# EAGLE design Mixer-Analog-OPA4134-Rev-M2-multi (EAGLE 8.6.0)
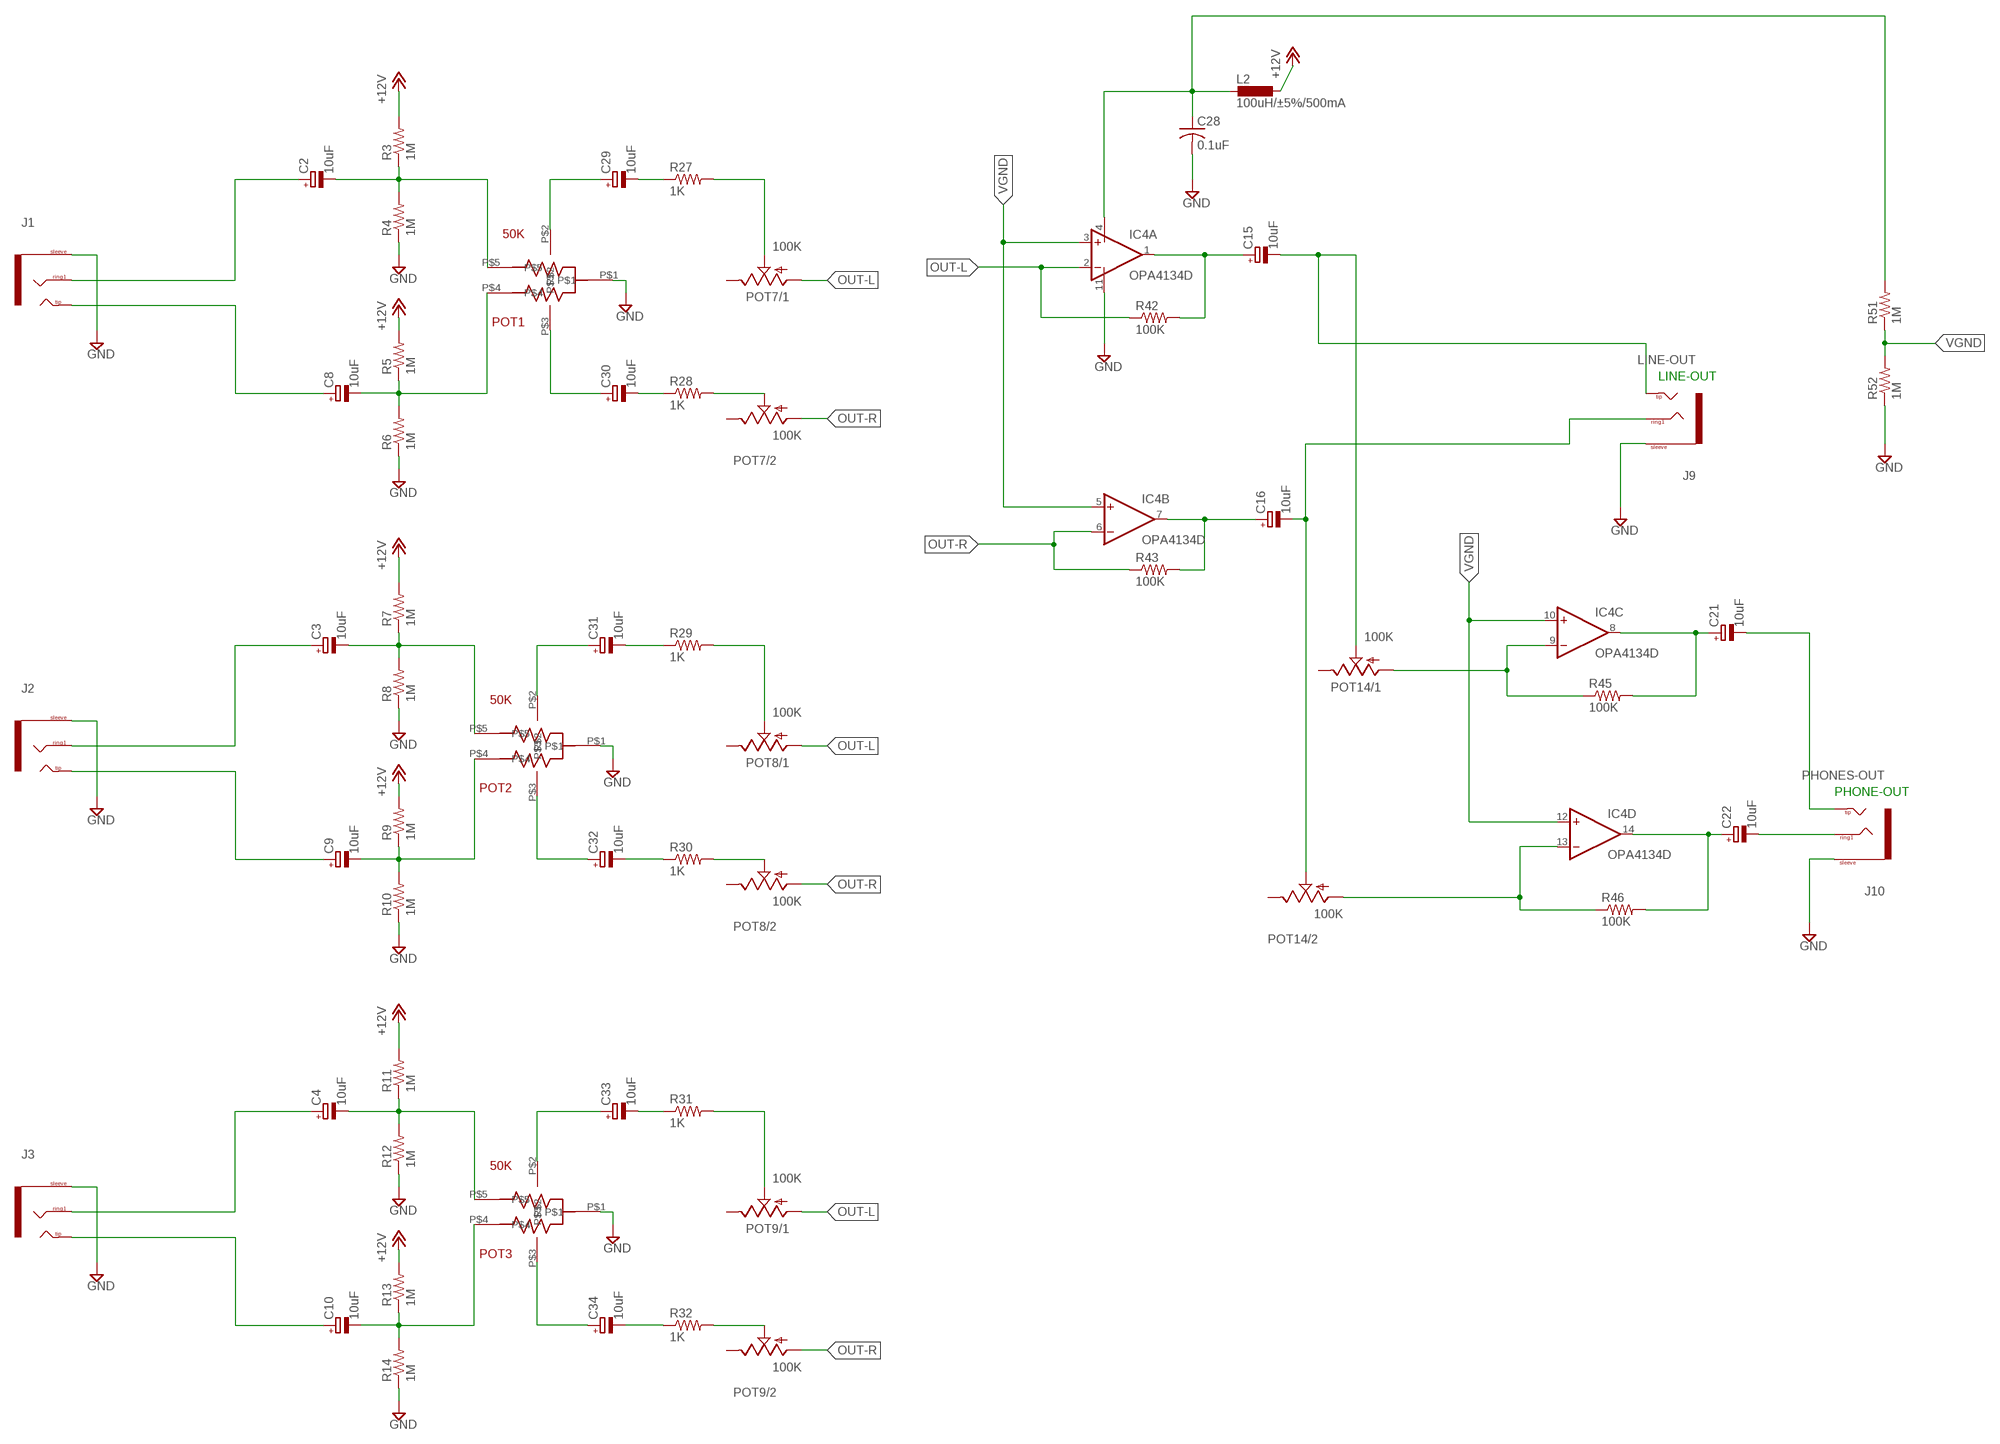
[diagram p0: schematic, sheet 1, part 1 of 2]
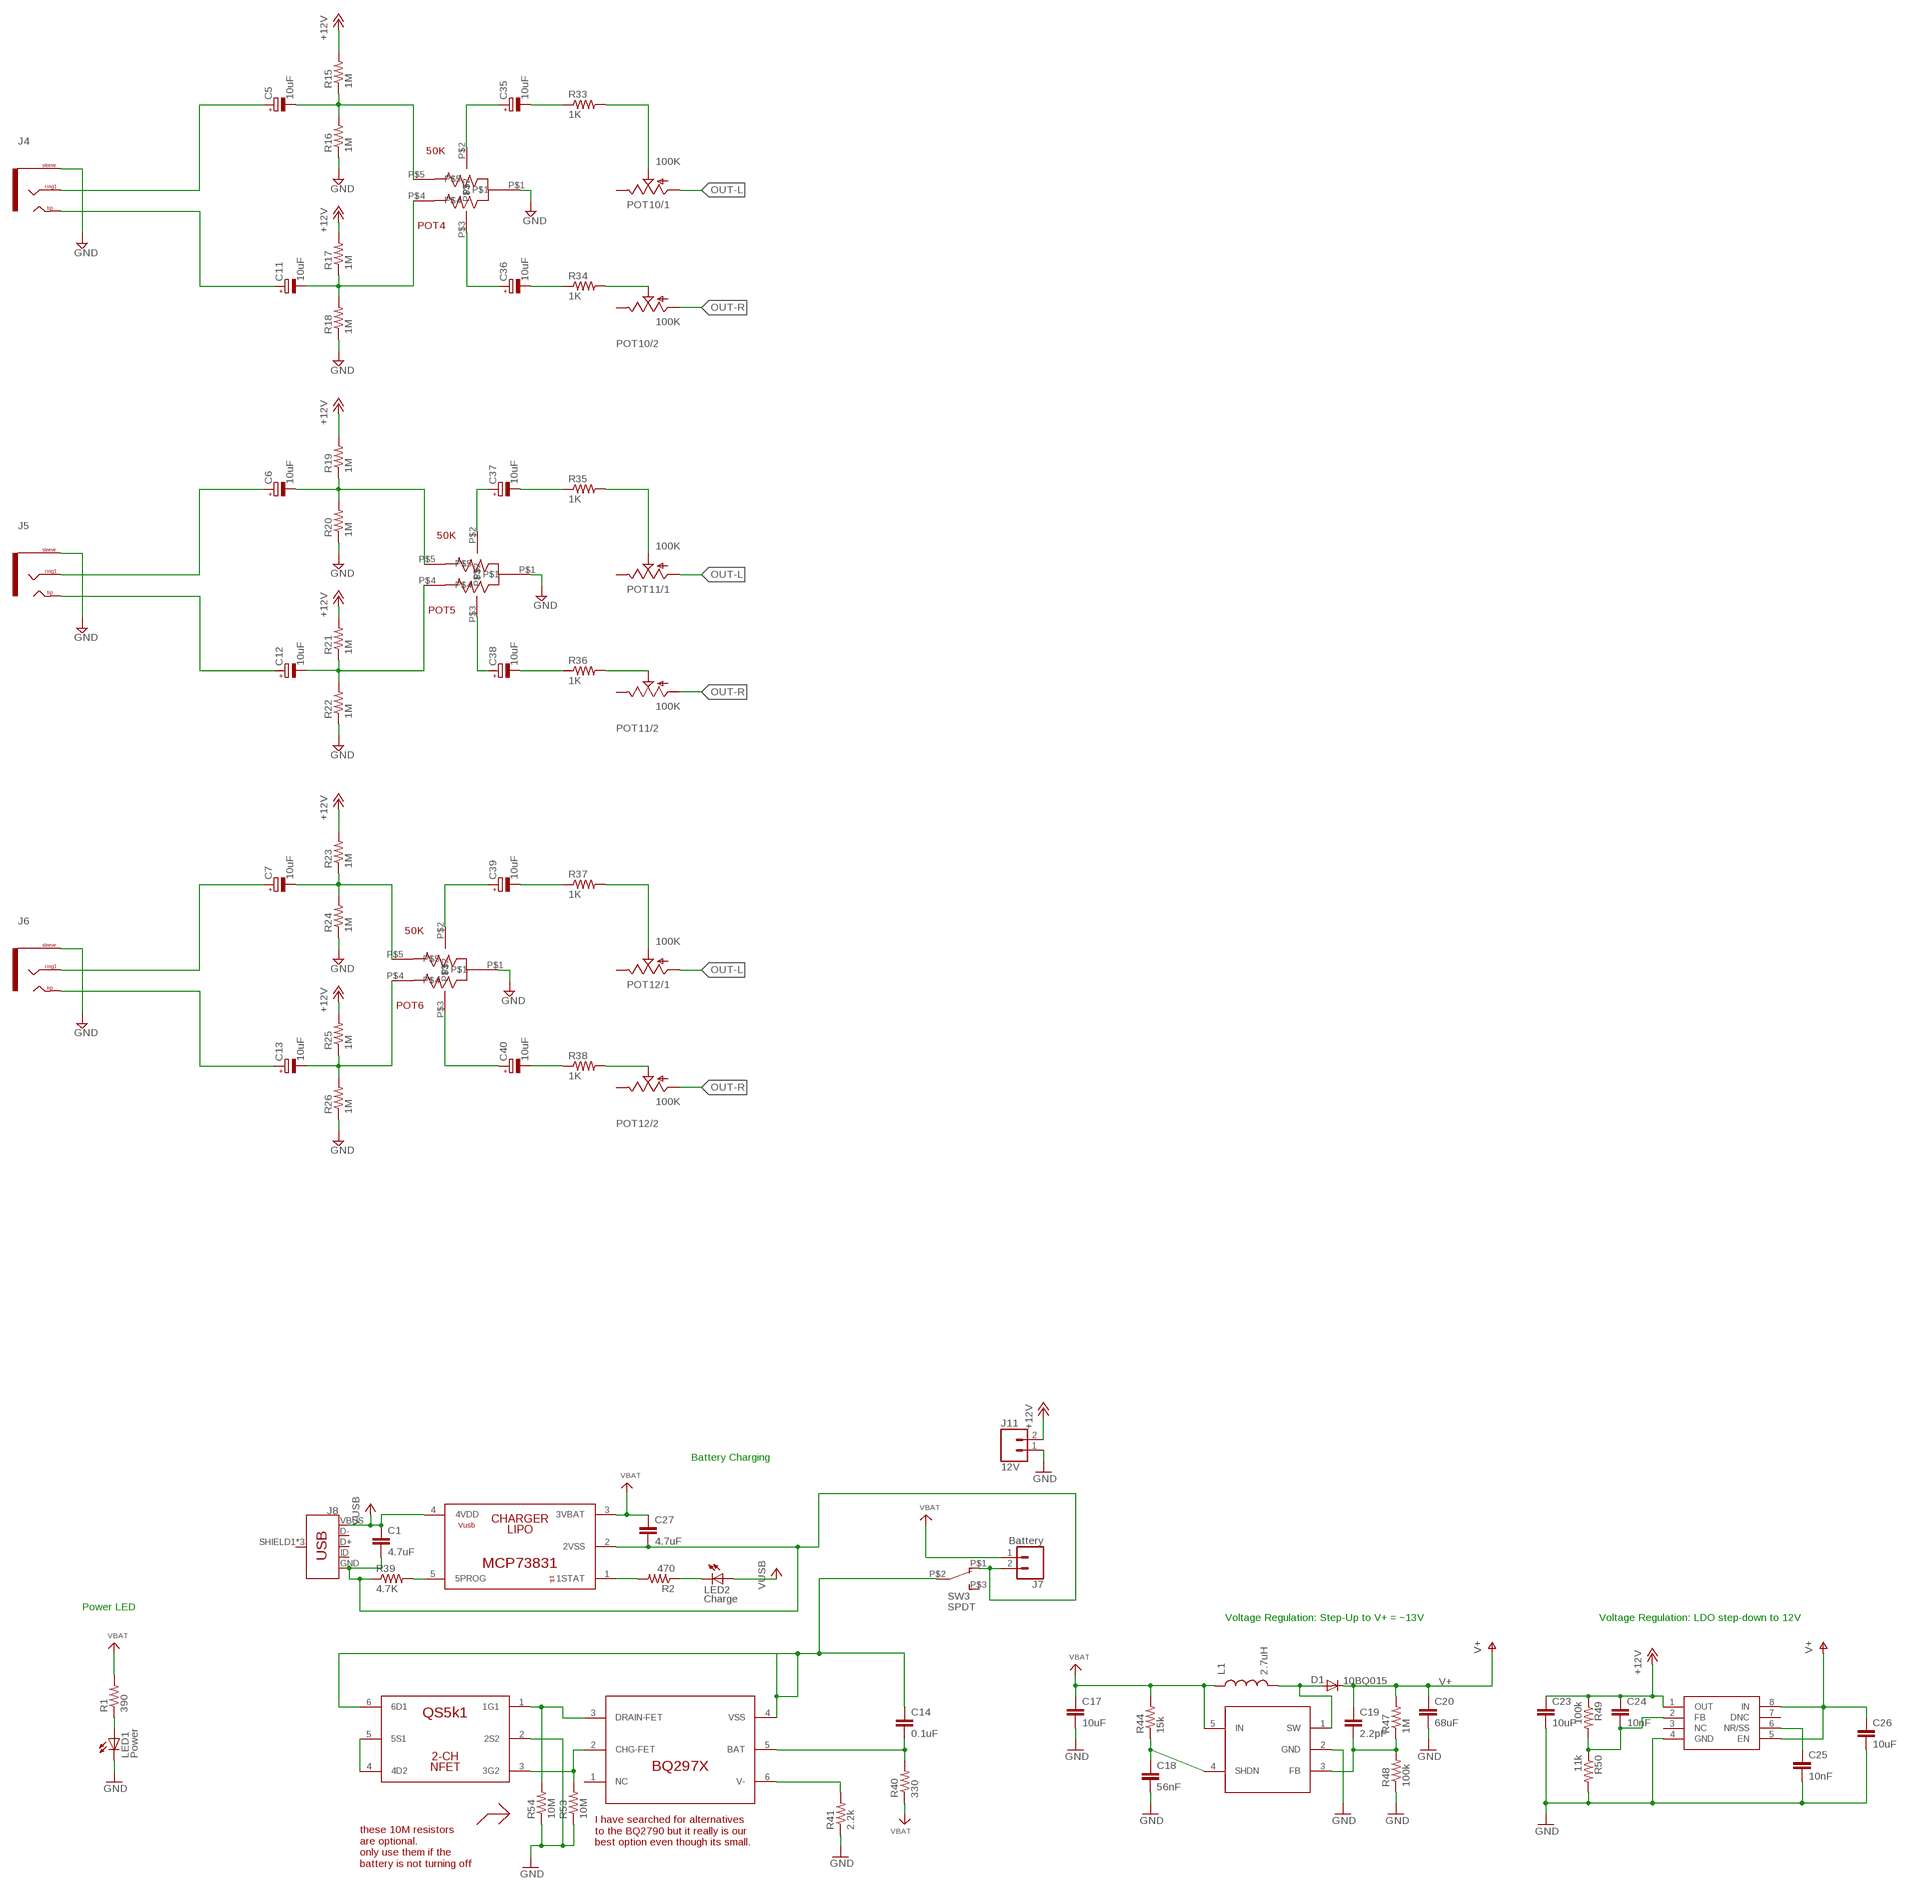
[diagram p1: schematic, sheet 1, part 2 of 2]

## Parts
C1  4.7uF  C-EUC0603  [C0603]
C2  10uF  CPOL-EUB  [PANASONIC_B]
C3  10uF  CPOL-EUB  [PANASONIC_B]
C4  10uF  CPOL-EUB  [PANASONIC_B]
C5  10uF  CPOL-EUB  [PANASONIC_B]
C6  10uF  CPOL-EUB  [PANASONIC_B]
C7  10uF  CPOL-EUB  [PANASONIC_B]
C8  10uF  CPOL-EUB  [PANASONIC_B]
C9  10uF  CPOL-EUB  [PANASONIC_B]
C10  10uF  CPOL-EUB  [PANASONIC_B]
C11  10uF  CPOL-EUB  [PANASONIC_B]
C12  10uF  CPOL-EUB  [PANASONIC_B]
C13  10uF  CPOL-EUB  [PANASONIC_B]
C14  0.1uF  C-EUC0603  [C0603]
C15  10uF  CPOL-EUB  [PANASONIC_B]
C16  10uF  CPOL-EUB  [PANASONIC_B]
C17  10uF  C-EUC0603  [C0603]
C18  56nF  C-EUC0603  [C0603]
C19  2.2pF  C-EUC0603  [C0603]
C20  68uF  C-EUC1206  [C1206]
C21  10uF  CPOL-EUB  [PANASONIC_B]
C22  10uF  CPOL-EUB  [PANASONIC_B]
C23  10uF  C-EUC0603  [C0603]
C24  10nF  C-EUC0603  [C0603]
C25  10nF  C-EUC0603  [C0603]
C26  10uF  C-EUC0603  [C0603]
C27  4.7uF  C-EUC0603  [C0603]
C28  0.1uF  C-USC0805K  [C0805K]
C29  10uF  CPOL-EUB  [PANASONIC_B]
C30  10uF  CPOL-EUB  [PANASONIC_B]
C31  10uF  CPOL-EUB  [PANASONIC_B]
C32  10uF  CPOL-EUB  [PANASONIC_B]
C33  10uF  CPOL-EUB  [PANASONIC_B]
C34  10uF  CPOL-EUB  [PANASONIC_B]
C35  10uF  CPOL-EUB  [PANASONIC_B]
C36  10uF  CPOL-EUB  [PANASONIC_B]
C37  10uF  CPOL-EUB  [PANASONIC_B]
C38  10uF  CPOL-EUB  [PANASONIC_B]
C39  10uF  CPOL-EUB  [PANASONIC_B]
C40  10uF  CPOL-EUB  [PANASONIC_B]
D1  10BQ015  DIODESMA  [SMA-DIODE]
IC1  BQ297X  BQ297X-BATTERY-MANAGERLONG  [WSON-6-LONG]
IC2  MCP73831  [SOT-23-5]
IC3  QS6K1  [SOT457R_PHILIPS]
IC4  OPA4134D  [SO14]
IC5  SC4503  [SOT23-5]
IC6  TPS7A49  [MSOP-8]
J1  TRS-1/8"-3.5MM  [TRS_SJ-3524-SMT]
J2  TRS-1/8"-3.5MM  [TRS_SJ-3524-SMT]
J3  TRS-1/8"-3.5MM  [TRS_SJ-3524-SMT]
J4  TRS-1/8"-3.5MM  [TRS_SJ-3524-SMT]
J5  TRS-1/8"-3.5MM  [TRS_SJ-3524-SMT]
J6  TRS-1/8"-3.5MM  [TRS_SJ-3524-SMT]
J7  Battery  CONN_02LOCK  [1X02_LOCK]
J8  USB_MICRO-BREDUCED_PASTE  [USB-B-MICRO-SMD_RED_PASTE]
J9  LINE-OUT  TRS-1/8"-3.5MM  [TRS_SJ-3524-SMT]
J10  PHONES-OUT  TRS-1/8"-3.5MM  [TRS_SJ-3524-SMT]
J11  12V  CONN_02LOCK  [1X02_LOCK]
L1  2.7uH  INDUCTORCR54-KIT  [CR54-KIT]
L2  100uH/±5%/500mA  L-EUL3225M  [L3225M]
LED1  Power  LED3MM  [LED3MM]
LED2  Charge  LED3MM  [LED3MM]
POT1  50K  POT-DUAL-ALPS-RK10J12E0A0A  [POT-DUAL-ALPS-RK10J12E0A0A]
POT2  50K  POT-DUAL-ALPS-RK10J12E0A0A  [POT-DUAL-ALPS-RK10J12E0A0A]
POT3  50K  POT-DUAL-ALPS-RK10J12E0A0A  [POT-DUAL-ALPS-RK10J12E0A0A]
POT4  50K  POT-DUAL-ALPS-RK10J12E0A0A  [POT-DUAL-ALPS-RK10J12E0A0A]
POT5  50K  POT-DUAL-ALPS-RK10J12E0A0A  [POT-DUAL-ALPS-RK10J12E0A0A]
POT6  50K  POT-DUAL-ALPS-RK10J12E0A0A  [POT-DUAL-ALPS-RK10J12E0A0A]
POT7  100K  POT-DUAL-PTV112-4420  [PTV112]
POT8  100K  POT-DUAL-PTV112-4420  [PTV112]
POT9  100K  POT-DUAL-PTV112-4420  [PTV112]
POT10  100K  POT-DUAL-PTV112-4420  [PTV112]
POT11  100K  POT-DUAL-PTV112-4420  [PTV112]
POT12  100K  POT-DUAL-PTV112-4420  [PTV112]
POT14  100K  POT-DUAL-PTV112-4420  [PTV112]
R1  390  R-US_R0603  [R0603]
R2  470  R-US_R0603  [R0603]
R3  1M  RESISTOR0603-RES  [0603-RES]
R4  1M  RESISTOR0603-RES  [0603-RES]
R5  1M  RESISTOR0603-RES  [0603-RES]
R6  1M  RESISTOR0603-RES  [0603-RES]
R7  1M  RESISTOR0603-RES  [0603-RES]
R8  1M  RESISTOR0603-RES  [0603-RES]
R9  1M  RESISTOR0603-RES  [0603-RES]
R10  1M  RESISTOR0603-RES  [0603-RES]
R11  1M  RESISTOR0603-RES  [0603-RES]
R12  1M  RESISTOR0603-RES  [0603-RES]
R13  1M  RESISTOR0603-RES  [0603-RES]
R14  1M  RESISTOR0603-RES  [0603-RES]
R15  1M  RESISTOR0603-RES  [0603-RES]
R16  1M  RESISTOR0603-RES  [0603-RES]
R17  1M  RESISTOR0603-RES  [0603-RES]
R18  1M  RESISTOR0603-RES  [0603-RES]
R19  1M  RESISTOR0603-RES  [0603-RES]
R20  1M  RESISTOR0603-RES  [0603-RES]
R21  1M  RESISTOR0603-RES  [0603-RES]
R22  1M  RESISTOR0603-RES  [0603-RES]
R23  1M  RESISTOR0603-RES  [0603-RES]
R24  1M  RESISTOR0603-RES  [0603-RES]
R25  1M  RESISTOR0603-RES  [0603-RES]
R26  1M  RESISTOR0603-RES  [0603-RES]
R27  1K  RESISTOR0603-RES  [0603-RES]
R28  1K  RESISTOR0603-RES  [0603-RES]
R29  1K  RESISTOR0603-RES  [0603-RES]
R30  1K  RESISTOR0603-RES  [0603-RES]
R31  1K  RESISTOR0603-RES  [0603-RES]
R32  1K  RESISTOR0603-RES  [0603-RES]
R33  1K  RESISTOR0603-RES  [0603-RES]
R34  1K  RESISTOR0603-RES  [0603-RES]
R35  1K  RESISTOR0603-RES  [0603-RES]
R36  1K  RESISTOR0603-RES  [0603-RES]
R37  1K  RESISTOR0603-RES  [0603-RES]
R38  1K  RESISTOR0603-RES  [0603-RES]
R39  4.7K  R-US_R0603  [R0603]
R40  330  R-US_R0603  [R0603]
R41  2.2k  R-US_R0603  [R0603]
R42  100K  RESISTOR0603-RES  [0603-RES]
R43  100K  RESISTOR0603-RES  [0603-RES]
R44  15k  R-US_R0603  [R0603]
R45  100K  RESISTOR0603-RES  [0603-RES]
R46  100K  RESISTOR0603-RES  [0603-RES]
R47  1M  R-US_R0603  [R0603]
R48  100k  R-US_R0603  [R0603]
R49  100k  R-US_R0603  [R0603]
R50  11k  R-US_R0603  [R0603]
R51  1M  RESISTOR0603-RES  [0603-RES]
R52  1M  RESISTOR0603-RES  [0603-RES]
R53  10M  R-US_R0603  [R0603]
R54  10M  R-US_R0603  [R0603]
SW3  SPDT  SWITCH_SPDTCL-SB-12B  [SWITCH_SPDT_CL-SB-12B]

## Nets
+5V: C1.1 IC2.4(4VDD) J8.VBUS LED2.A ; supply symbol labelled VUSB
+12V: C23.1 C24.1 IC6.1(OUT) J11.2 L2.1 R3.2 R5.2 R7.2 R9.2 R11.2 R13.2 R15.2 R17.2 R19.2 R21.2 R23.2 R25.2 R49.1
BATGND: C14.1 IC1.4(VSS) IC3.6(6D1) SW3.P$2
GND: C17.2 C18.2 C20.2 C23.2 C25.2 C26.2 C28.2 IC3.2(2S2) IC4.11(P:V-) IC6.4(GND) J1.1(SLEEVE) J2.1(SLEEVE) J3.1(SLEEVE) J4.1(SLEEVE) J5.1(SLEEVE) J6.1(SLEEVE) J9.1(SLEEVE) J10.1(SLEEVE) J11.1 LED1.K(C) POT1.P$1 POT2.P$1 POT3.P$1 POT4.P$1 POT5.P$1 POT6.P$1 R4.1 R6.1 R8.1 R10.1 R12.1 R14.1 R16.1 R18.1 R20.1 R22.1 R24.1 R26.1 R41.1 R48.1 R50.2 R52.1 R53.1 R54.1
N$1: C8.+ J1.2(TIP) J1.4(TIP)
N$2: LED2.K(C) R2.1
N$3: C8.- POT1.P$4 R5.1 R6.2
N$4: C14.2 IC1.5(BAT) R40.2
N$5: C29.+ POT1.P$2
N$6: IC2.5(5PROG) R39.2
N$7: C15.+ IC4.1(A:OUT) R42.2
N$8: C2.+ J1.3(RING1)
N$9: C30.+ POT1.P$3
N$10: IC2.1(1STAT) R2.2
N$11: IC3.4(4D2) IC3.5(5S1)
N$12: IC1.3(DRAIN-FET) IC3.1(1G1) R54.2
N$13: C2.- POT1.P$5 R3.1 R4.2
N$14: IC1.2(CHG-FET) IC3.3(3G2) R53.2
N$15: IC4.13(D:-IN) POT14.2.1(/2:A) R46.1
N$17: C16.+ IC4.7(B:OUT) R43.2
N$19: POT7.2.2(/2:S) R28.2
N$20: C30.- R28.1
N$21: C22.- J10.3(RING1)
N$22: C9.- POT2.P$4 R9.1 R10.2
N$23: C21.- J10.2(TIP) J10.4(TIP)
N$24: C21.+ IC4.8(C:OUT) R45.2
N$25: C22.+ IC4.14(D:OUT) R46.2
N$26: C31.+ POT2.P$2
N$27: POT8.1.2(/1:S) R29.2
N$28: C9.+ J2.2(TIP) J2.4(TIP)
N$29: C3.+ J2.3(RING1)
N$30: C31.- R29.1
N$31: C3.- POT2.P$5 R7.1 R8.2
N$32: POT8.2.2(/2:S) R30.2
N$33: C28.1 IC4.4(P:V+) L2.2 R51.2
N$34: IC1.6(V-) R41.2
N$35: C29.- R27.1
N$36: C32.- R30.1
N$37: C32.+ POT2.P$3
N$38: C33.+ POT3.P$2
N$39: C33.- R31.1
N$40: C34.- R32.1
N$41: C10.- POT3.P$4 R13.1 R14.2
N$42: C34.+ POT3.P$3
N$43: POT9.1.2(/1:S) R31.2
N$44: C10.+ J3.2(TIP) J3.4(TIP)
N$45: C4.+ J3.3(RING1)
N$46: C35.+ POT4.P$2
N$47: C4.- POT3.P$5 R11.1 R12.2
N$48: POT9.2.2(/2:S) R32.2
N$49: C36.+ POT4.P$3
N$50: C35.- R33.1
N$51: C36.- R34.1
N$52: C37.+ POT5.P$2
N$53: C37.- R35.1
N$54: C38.+ POT5.P$3
N$55: POT7.1.2(/1:S) R27.2
N$56: C38.- R36.1
N$57: C39.+ POT6.P$2
N$58: C11.- POT4.P$4 R17.1 R18.2
N$59: C39.- R37.1
N$60: POT10.1.2(/1:S) R33.2
N$61: C15.- J9.2(TIP) J9.4(TIP) POT14.1.2(/1:S)
N$62: C11.+ J4.2(TIP) J4.4(TIP)
N$63: C5.+ J4.3(RING1)
N$64: C40.- R38.1
N$65: C5.- POT4.P$5 R15.1 R16.2
N$66: POT10.2.2(/2:S) R34.2
N$67: C40.+ POT6.P$3
N$75: C12.- POT5.P$4 R21.1 R22.2
N$77: POT11.1.2(/1:S) R35.2
N$78: C12.+ J5.2(TIP) J5.4(TIP)
N$79: C6.+ J5.3(RING1)
N$81: C6.- POT5.P$5 R19.1 R20.2
N$82: POT11.2.2(/2:S) R36.2
N$91: C13.- POT6.P$4 R25.1 R26.2
N$93: POT12.1.2(/1:S) R37.2
N$94: C13.+ J6.2(TIP) J6.4(TIP)
N$95: C7.+ J6.3(RING1)
N$97: C7.- POT6.P$5 R23.1 R24.2
N$98: POT12.2.2(/2:S) R38.2
N$114: LED1.A R1.1
N$115: D1.A IC5.1(SW) L1.P$2
N$116: C18.1 IC5.4(SHDN) R44.1
N$117: C19.2 IC5.3(FB) R47.1 R48.2
N$118: C24.2 IC6.2(FB) R49.2 R50.1
N$119: C25.1 IC6.6(NR/SS)
OUT-L: IC4.2(A:-IN) POT7.1.1(/1:A) POT8.1.1(/1:A) POT9.1.1(/1:A) POT10.1.1(/1:A) POT11.1.1(/1:A) POT12.1.1(/1:A) R42.1
OUT-L1: IC4.9(C:-IN) POT14.1.1(/1:A) R45.1
OUT-R: IC4.6(B:-IN) POT7.2.1(/2:A) POT8.2.1(/2:A) POT9.2.1(/2:A) POT10.2.1(/2:A) POT11.2.1(/2:A) POT12.2.1(/2:A) R43.1
OUT-R1: C16.- J9.3(RING1) POT14.2.2(/2:S)
USBGND: C1.2 C27.2 IC2.2(2VSS) J7.2 J8.GND R39.1 SW3.P$1
V+: C19.1 C20.1 C26.1 D1.C IC6.5(EN) IC6.8(IN) R47.2
VBAT: C17.1 C27.1 IC2.3(3VBAT) IC5.5(IN) J7.1 L1.P$1 R1.2 R40.1 R44.2
VGND: IC4.3(A:+IN) IC4.5(B:+IN) IC4.10(C:+IN) IC4.12(D:+IN) R51.1 R52.2
Unconnected: IC1.1(NC) IC5.2(GND) IC6.3(NC) IC6.7(DNC) J8.D+ J8.D- J8.ID J8.SHIELD1(SHIELD) J8.SHIELD2(SHIELD) J8.SHIELD3(SHIELD) POT7.1.3(/1:E) POT7.2.3(/2:E) POT8.1.3(/1:E) POT8.2.3(/2:E) POT9.1.3(/1:E) POT9.2.3(/2:E) POT10.1.3(/1:E) POT10.2.3(/2:E) POT11.1.3(/1:E) POT11.2.3(/2:E) POT12.1.3(/1:E) POT12.2.3(/2:E) POT14.1.3(/1:E) POT14.2.3(/2:E) SW3.P$3

## Notes on the sheet
- LINE-OUT
- PHONE-OUT
- Battery Charging
- Power LED
- Voltage Regulation: Step-Up to V+ = ~13V | Voltage Regulation: LDO step-down to 12V
- I have searched for alternatives 
  to the BQ2790 but it really is our 
  best option even though its small.
- these 10M resistors
  are optional. 
  only use them if the 
  battery is not turning off

## Library data of the parts
C1 C14 C17-C20 C23-C27 = rcl:C-EU: CAPACITOR, European symbol; SPICEPREFIX: C
C2-C13 C15 C16 C21 C22 C29-C40 = CMU-ArtFab:CPOL-EU: POLARIZED CAPACITOR, European symbol
C28 = adafruit:C-US: CAPACITOR, American symbol
D1 = SparkFun:DIODE: Diode These are standard reverse protection diodes and small signal diodes. SMA package can handle up to about 1A. SOD-323 can handle about 200mA. What the SOD-323 package when ordering, there are some mfgs out there that are 5-pin packages.
IC1 = CMU-ArtFab:BQ297X-BATTERY-MANAGER
IC2 = CMU-ArtFab:MCP73831
IC3 = CMU-ArtFab:QS6K1
IC4 = linear:OPA4134: SoundPLUS (TM) High Performance AUDIO OPERATIONAL AMPLIFIERS Source: http://focus.ti.com/lit/ds/sbos058/sbos058.pdf
IC5 = CMU-ArtFab:SC4503
IC6 = CMU-ArtFab:TPS7A49
J1-J6 J9 J10 = CMU-ArtFab:TRS-1/8"-3.5MM
J7 J11 = SparkFun-Connectors:CONN_02: Multi connection point. Often used as Generic Header-pin footprint for 0.1 inch spaced/style header connections On any of the 0.1 inch spaced packages, you can populate with these: Break Away Headers - Straight <https://www.sparkfun.com/products/116> (PRT-00116) Break Away Male Headers - Right Angle <https://www.sparkfun.com/products/553> (PRT-00553) Female Headers <https://www.sparkfun.com/products/115> (PRT-00115) Break Away Headers - Machine Pin <https://www.sparkfun.com/products/117> (PRT-00117) Break Away Female Headers - Swiss Machine Pin <https://www.sparkfun.com/products/743> (PRT-00743) For SCREWTERMINALS and SPRING TERMINALS visit here: Screw Terimnals on SparkFun.com <https://www.sparkfun.com/search/results?term=Screw+Terminals> (5mm/3.5mm/2.54mm spacing) This device is also useful as a general connection point to wire up your design to another part of your project. Our various solder wires solder well into these plated through hole pads. Hook-Up Wire - Assortment (Stranded, 22 AWG) <https://www.sparkfun.com/products/11375> (PRT-11375) Hook-Up Wire - Assortment (Solid Core, 22 AWG) <https://www.sparkfun.com/products/11367> (PRT-11367) View the entire wire category on our website here <https://www.sparkfun.com/categories/141> Special notes: Molex polarized connector foot print use with: PRT-08233 with associated crimp pins and housings. 2.54_SCREWTERM for use with PRT-10571. 3.5mm Screw Terminal footprints for PRT-08084 5mm Screw Terminal footprints for use with PRT-08432
J8 = CMU-ArtFab:USB_MICRO-B: USB Type Micro-B Connector Male/female and PTH/SMT variants SparkFun Products: SparkFun microB USB Breakout <https://www.sparkfun.com/products/12035> SparkFun USB microB Plug Breakout <https://www.sparkfun.com/products/10031> SparkFun ESP8266 Thing <https://www.sparkfun.com/products/13231>; PROD_ID: CONN-11752
L1 = SparkFun-Passives:INDUCTOR: Inductors Basic Inductor/Choke - 0603 and 1206. Footprints are not proven and vary greatly between part numbers. SRN6045- 33uH, 20% 1.4A SDR0403-560KL - 56uH, 10%, 500mA RMS/740mA peak
L2 = rcl:L-EU: INDUCTOR, European symbol; SPICEPREFIX: L
LED1 LED2 = led:LED: LED OSRAM: - CHIPLED LG R971, LG N971, LY N971, LG Q971, LY Q971, LO R971, LY R971 LH N974, LH R974 LS Q976, LO Q976, LY Q976 LO Q996 - Hyper CHIPLED LW Q18S LB Q993, LB Q99A, LB R99A - SideLED LS A670, LO A670, LY A670, LG A670, LP A670 LB A673, LV A673, LT A673, LW A673 LH A674 LY A675 LS A676, LA A676, LO A676, LY A676, LW A676 LS A679, LY A679, LG A679 - Hyper Micro SIDELED® LS Y876, LA Y876, LO Y876, LY Y876 LT Y87S - SmartLED LW L88C, LW L88S LB L89C, LB L89S, LG L890 LS L89K, LO L89K, LY L89K LS L896, LA L896, LO L896, LY L896 - TOPLED LS T670, LO T670, LY T670, LG T670, LP T670 LSG T670, LSP T670, LSY T670, LOP T670, LYG T670 LG T671, LOG T671, LSG T671 LB T673, LV T673, LT T673, LW T673 LH T674 LS T676, LA T676, LO T676, LY T676, LB T676, LH T676, LSB T676, LW T676 LB T67C, LV T67C, LT T67C, LS T67K, LO T67K, LY T67K, LW E67C LS E67B, LA E67B, LO E67B, LY E67B, LB E67C, LV E67C, LT E67C LW T67C LS T679, LY T679, LG T679 LS T770, LO T770, LY T770, LG T770, LP T770 LB T773, LV T773, LT T773, LW T773 LH T774 LS E675, LA E675, LY E675, LS T675 LS T776, LA T776, LO T776, LY T776, LB T776 LHGB T686 LT T68C, LB T68C - Hyper Mini TOPLED® LB M676 - Mini TOPLED Santana® LG M470 LS M47K, LO M47K, LY M47K Source: http://www.osram.convergy.de LUXEON: - LUMILED® LXK2-PW12-R00, LXK2-PW12-S00, LXK2-PW14-U00, LXK2-PW14-V00 LXK2-PM12-R00, LXK2-PM12-S00, LXK2-PM14-U00 LXK2-PE12-Q00, LXK2-PE12-R00, LXK2-PE12-S00, LXK2-PE14-T00, LXK2-PE14-U00 LXK2-PB12-K00, LXK2-PB12-L00, LXK2-PB12-M00, LXK2-PB14-N00, LXK2-PB14-P00, LXK2-PB14-Q00 LXK2-PR12-L00, LXK2-PR12-M00, LXK2-PR14-Q00, LXK2-PR14-R00 LXK2-PD12-Q00, LXK2-PD12-R00, LXK2-PD12-S00 LXK2-PH12-R00, LXK2-PH12-S00 LXK2-PL12-P00, LXK2-PL12-Q00, LXK2-PL12-R00 Source: www.luxeon.com KINGBRIGHT: KA-3528ASYC Source: www.kingbright.com
POT1-POT6 = CMU-ArtFab:POT-DUAL-ALPS-RK10J12E0A0A
POT7-POT12 POT14 = CMU-ArtFab:POT-DUAL-PTV112: Bourns 11mm dual potentiometer; AVAILABILITY: Unavailable; DESCRIPTION: Alt# Tce-10111410; MF: STMicroelectronics; MP: PTV112; PACKAGE: None; PRICE: None; SPICEPREFIX: J
R1 R2 R39-R41 R44 R47-R50 R53 R54 = CMU-ArtFab:R-US_: RESISTOR, American symbol
R3-R38 R42 R43 R45 R46 = SparkFun-Passives:RESISTOR: Resistor Basic schematic elements and footprints for 0603, 1206, and PTH resistors.; SPICEPREFIX: R
R51 R52 = SparkFun-Passives:RESISTOR: Resistor Basic schematic elements and footprints for 0603, 1206, and PTH resistors.
SW3 = CMU-ArtFab:SWITCH_SPDT

## Board
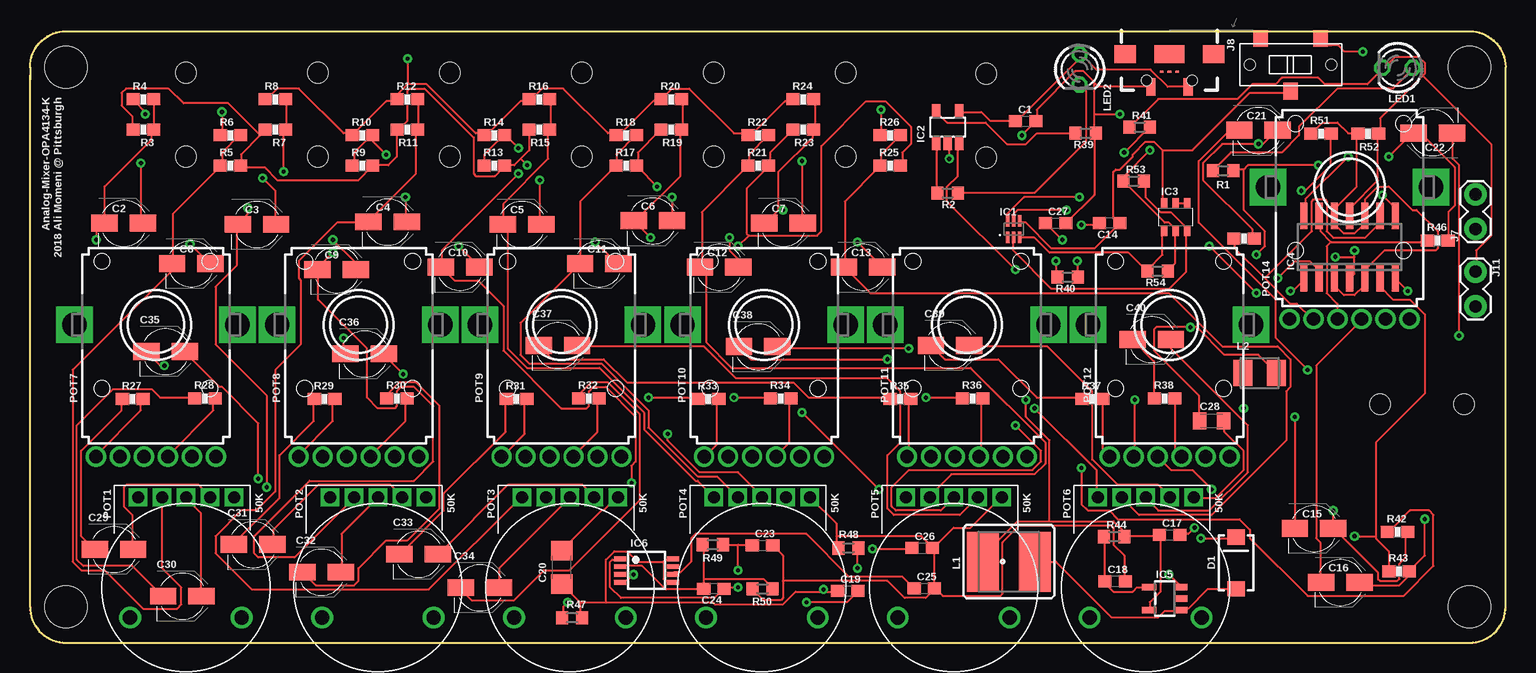
[diagram p2: board, top side]
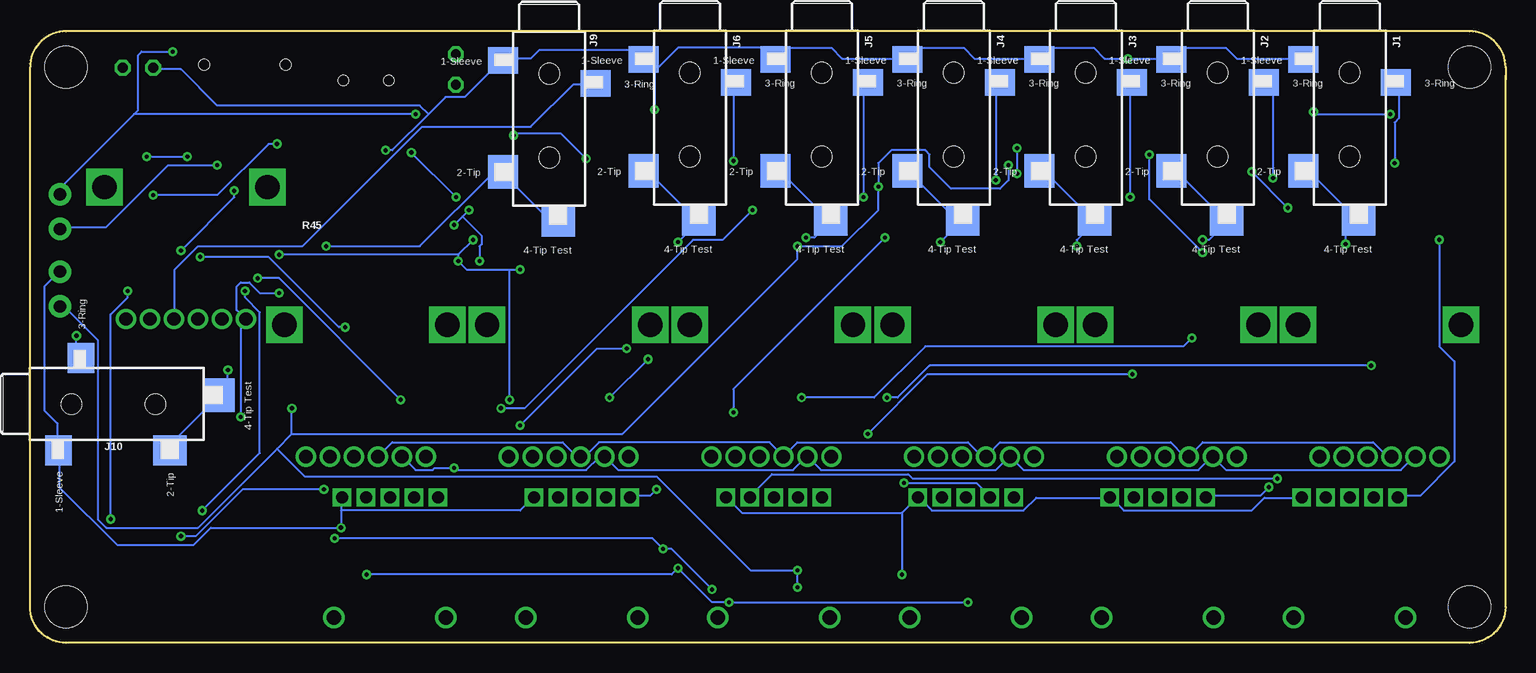
[diagram p3: board, bottom side, seen from below]

Size 123 x 51 mm. Coordinates in mm from the lower left corner, seen from the top.
Outline: 0,47 0,47.3
Outline: 0,47 0,48 arc-90 3,51 120,51 arc-90 123,48 123,3 arc-90 120,0 3,0 arc-90 0,3 0,47
Copper layers (1*16): Top 0.035mm / dielectric 1.5mm / Bottom 0.035mm
Design rules "default *": minimum track width 6mil, minimum drill 0.35mm, track to track 8mil, track to pad 8mil, pad to pad 8mil, via to via 8mil, smd to smd 8mil, copper to edge 40mil, drill to drill 6mil, minimum pad ring 10mil, minimum via ring 8mil, stop-mask expansion 4mil, vias tented up to drill 0mil, thermal gap 10mil
Holes 3.5 mm at 3,48 3,3 120,3 120,48

### Footprints (pad centres in the part's own frame; a part is rotated, then mirrored left to right if it is on the bottom)
C0603 = smd 1.1 x 1: 1 -0.85,0; 2 0.85,0
PANASONIC_B = smd 2.2 x 1.4: + 1.6,0; - -1.6,0
C1206 = smd 1.6 x 1.8: 1 -1.4,0; 2 1.4,0
C0805K = smd 1.1 x 1.4: 1 -1,0; 2 1,0
SMA-DIODE = smd 1.27 x 1.47: A -2.15,0; C 2.15,0
WSON-6-LONG = smd 0.3 x 0.954: 1 -0.5,-0.686; 2 0,-0.686; 3 0.5,-0.686; 4 0.5,0.686; 5 0,0.686; 6 -0.5,0.686
SOT-23-5 = smd 0.69 x 1.2: 1 -0.95,-1.3; 2 0,-1.3; 3 0.95,-1.3; 4 0.95,1.3; 5 -0.95,1.3
SOT457R_PHILIPS = smd 0.55 x 0.8: 1 -0.95,-1.2; 2 0,-1.2; 3 0.95,-1.2; 4 0.95,1.2; 5 0,1.2; 6 -0.95,1.2
SO14 = smd 0.6 x 2.2: 1 -3.81,-2.6; 2 -2.54,-2.6; 3 -1.27,-2.6; 4 0,-2.6; 5 1.27,-2.6; 6 2.54,-2.6; 7 3.81,-2.6; 8 3.81,2.6; 9 2.54,2.6; 10 1.27,2.6; 11 0,2.6; 12 -1.27,2.6; 13 -2.54,2.6; 14 -3.81,2.6
SOT23-5 = smd 0.55 x 1.2: 1 -0.95,-1.3; 2 0,-1.3; 3 0.95,-1.3; 4 0.95,1.3; 5 -0.95,1.3
MSOP-8 = smd 0.4 x 1: 1 -0.975,-2.2; 2 -0.325,-2.2; 3 0.325,-2.2; 4 0.975,-2.2; 5 0.975,2.2; 6 0.325,2.2; 7 -0.325,2.2; 8 -0.975,2.2
TRS_SJ-3524-SMT = smd 2.5 x 2.2: 1 3.85,-4.6; 3 -3.85,-2.7 | smd 2.5 x 2.8: 2 3.85,4.7 | smd 2.8 x 2.5: 4 -0.75,8.85 | hole 1.7: 0,-3.5; 0,3.5
1X02_LOCK = drill 1.016 pad 1.88: 1 -0.178,0; 2 2.718,0
USB-B-MICRO-SMD_RED_PASTE = smd 0.152 x 0.305: D+ 1.455,0; D- 1.455,0.65; ID 1.455,-0.65 | smd 1.45 x 0.762: GND 2.725,-1.554 | smd 1.5 x 1.8: SHIELD1 0,3.685; SHIELD2 0,-3.685 | smd 1.5 x 2.5: SHIELD3 0,0 | smd 1.45 x 0.781: VBUS 2.725,1.554 | hole 0.85: 2.2,1.9; 2.2,-1.9
CR54-KIT = smd 5 x 2.65: P$1 0,2.17; P$2 0,-2.17
L3225M = smd 1.6 x 2.2: 1 -1.4,0; 2 1.4,0
LED3MM = drill 0.813 octagon: A -1.27,0; K 1.27,0
POT-DUAL-ALPS-RK10J12E0A0A = drill 1 pad 1.321 square: P$1 -4,0; P$2 -2,0; P$3 0,0; P$4 2,0; P$5 4,0 | drill 1.2: P$6 4.65,10; P$7 -4.65,10
PTV112 = drill 1.1 pad 1.676: 1.1 -3,-11; 1.2 -5,-11; 1.3 5,-11; 2.1 -1,-11; 2.2 1,-11; 2.3 3,-11 | drill 2.032 pad 2.8 square: M1 -6.8,0; M2 6.8,0
R0603 = smd 1 x 1.1: 1 -0.85,0; 2 0.85,0
0603-RES = smd 1.1 x 1: 1 -0.85,0; 2 0.85,0
SWITCH_SPDT_CL-SB-12B = smd 1.2 x 1.4: P$1 -2.5,-2.2; P$2 0,2.2; P$3 2.5,-2.2 | hole 0.9: -3.4,0; 3.4,0

### Placement (x,y rotation side)
C1  83,43.5 0 top
C2  7.82,35 0 top
C3  18.92,34.9 0 top
C4  29.82,35.1 0 top
C5  41.02,34.9 0 top
C6  51.92,35.2 0 top
C7  62.82,35 0 top
C8  13.45,31.63 0 top
C9  25.55,31.13 0 top
C10  35.85,31.33 0 top
C11  47.45,31.63 0 top
C12  57.45,31.33 0 top
C13  69.45,31.33 0 top
C14  90,35 180 top
C15  107.04,9.54 0 top
C16  109.23,5.04 0 top
C17  95,9 0 top
C18  90.46,5.14 0 top
C19  68.18,4.33 0 top
C20  44.33,6.29 90 top
C21  102.41,42.74 0 top
C22  116.93,42.51 180 top
C23  61.06,8.13 0 top
C24  57.01,4.52 180 top
C25  74.55,4.54 0 top
C26  74.38,7.9 0 top
C27  85.5,35 0 top
C28  98.5,18.5 0 top
C29  7,7.8 0 top
C30  12.7,3.9 0 top
C31  18.6,8.2 0 top
C32  24.3,5.9 0 top
C33  32.4,7.4 0 top
C34  37.5,4.6 0 top
C35  11.3,24.3 0 top
C36  27.9,24.1 0 top
C37  44,24.8 0 top
C38  60.7,24.7 0 top
C39  76.7,24.8 0 top
C40  93.5,25.3 0 top
D1  100.53,6.66 90 top
IC1  82,34.5 0 top
IC2  76.5,43 0 top
IC3  95.5,35.5 0 top
IC4  110,33 0 top
IC5  94.59,3.69 90 top
IC6  51.39,6.03 270 top
J1  13,44.04 180 bottom
J2  24,44.04 180 bottom
J3  35,44.04 180 bottom
J4  46,44.04 180 bottom
J5  57,44.04 180 bottom
J6  68,44.04 180 bottom
J7  120.5,34.68 90 top
J8  94.98,49.09 270 top
J9  79.72,43.96 180 bottom
J10  116.04,19.9 270 bottom
J11  120.5,30.77 270 top
L1  81.6,6.77 90 top
L2  102.5,22.5 0 top
LED1  114,47.95 180 top
LED2  87.5,47.81 270 top
POT1  13,12.12 180 top
POT2  29,12.12 180 top
POT3  45,12.12 180 top
POT4  61,12.12 180 top
POT5  77,12.12 180 top
POT6  93,12.12 180 top
POT7  10.5,26.52 0 top
POT8  27.4,26.52 0 top
POT9  44.3,26.52 0 top
POT10  61.2,26.52 0 top
POT11  78.1,26.52 0 top
POT12  95,26.52 0 top
POT14  110,38 0 top
R1  99.46,39.37 0 top
R2  76.5,37.5 180 top
R3  9.46,42.8 180 top
R4  9.46,45.32 0 top
R5  16.7,39.79 0 top
R6  16.72,42.32 0 top
R7  20.46,42.8 180 top
R8  20.46,45.32 0 top
R9  27.7,39.79 0 top
R10  27.72,42.32 0 top
R11  31.46,42.8 180 top
R12  31.46,45.32 0 top
R13  38.7,39.79 0 top
R14  38.72,42.32 0 top
R15  42.46,42.8 180 top
R16  42.46,45.32 0 top
R17  49.7,39.79 0 top
R18  49.72,42.32 0 top
R19  53.46,42.8 180 top
R20  53.46,45.32 0 top
R21  60.7,39.79 0 top
R22  60.72,42.32 0 top
R23  64.46,42.8 180 top
R24  64.46,45.32 0 top
R25  71.7,39.79 0 top
R26  71.72,42.32 0 top
R27  8.56,20.33 0 top
R28  14.59,20.38 0 top
R29  24.56,20.33 0 top
R30  30.59,20.38 0 top
R31  40.56,20.33 0 top
R32  46.59,20.38 0 top
R33  56.56,20.33 0 top
R34  62.59,20.38 0 top
R35  72.56,20.33 0 top
R36  78.59,20.38 0 top
R37  88.56,20.33 0 top
R38  94.59,20.38 0 top
R39  88,42.5 180 top
R40  86.5,30.5 180 top
R41  92.5,43 0 top
R42  114,9.24 0 top
R43  114.14,5.97 0 top
R44  90.38,8.86 0 top
R45  101.2,33.72 0 top
R46  117.35,33.55 0 top
R47  45.19,2.1 0 top
R48  68.23,7.9 0 top
R49  56.91,8.18 180 top
R50  61.06,4.5 180 top
R51  107.61,42.46 0 top
R52  111.56,42.44 180 top
R53  92,38.5 0 top
R54  94,31 180 top
SW3  105.09,48.21 180 top

### Tracks (layer width: path | path; a pad name or v marks a point on that pad's centre or on a via)
+5V
  Top 0.152: IC2.4 77.52,44.27 79.3,44.27 80.01,43.56 82.14,43.56 C1.1 82.32,43.56 87.48,48.72 87.48,49.07 | 87.48,49.07 LED2.A | J8.VBUS 94.84,46.36 93.4,47.8 88.9,47.8 87.63,49.07 87.48,49.07
+12V  (via drill 0.35)
  Top 0.152: R19.2 52.45,42.67 50.67,40.89 50.67,39.83 R17.2 50.67,39.65 v52.27,38.05 | R23.2 63.48,42.67 61.7,40.89 61.7,39.83 R21.2 61.52,39.65 59.74,37.87 59.74,34.14 59.92,33.96 | 59.92,33.96 65.61,33.96 65.96,34.31 65.96,41.43 69.7,45.16 71.3,45.16 73.43,43.03 73.43,41.6 72.72,40.89 72.72,39.83 R25.2 | 59.92,33.96 v59.03,33.07 | 40.89,40.36 41.6,41.07 41.6,42.67 R15.2 | 40.89,40.36 40.36,39.83 39.65,39.83 R13.2 39.47,39.65 38.76,38.94 37.16,38.94 36.98,39.12 36.98,42.14 32.89,46.23 31.65,46.23 31.47,46.05 31.47,43.56 30.76,42.85 R11.2 30.58,42.67 30.58,40.54 29.87,39.83 28.63,39.83 R9.2 28.45,39.65 27.38,38.58 20.62,38.58 19.56,39.65 17.6,39.65 R5.2 17.6,39.83 17.6,40.72 19.2,42.32 | 19.2,42.32 19.56,42.67 R7.2 19.2,42.32 | 19.2,42.32 16.54,44.98 12.8,44.98 11.56,46.23 8,46.23 7.64,45.87 7.64,44.81 8.53,43.92 8.53,42.85 R3.2 | 40.89,40.36 v41.43,39.83 | 59.03,8.18 57.78,8.18 R49.1 | 59.03,8.18 60.1,8.18 C23.1 | IC6.1 49.07,6.93 48.54,6.93 48.36,6.76 48.36,4.62 49.25,3.73 57.07,3.73 C24.1 57.96,4.62 v59.03,4.62 | v59.03,6.04 59.03,8.18 | v101.17,19.56 101.17,22.4 L2.1
  Bottom 0.152: v41.43,39.83 41.43,38.58 42.14,37.87 46.23,37.87 48.01,39.65 48.01,40.72 48.36,41.07 51.21,41.07 52.27,40.01 v52.27,38.05 52.27,36.09 55.3,33.07 v59.03,33.07 59.03,32 73.61,17.42 101.17,17.42 | v59.03,4.62 v59.03,6.04 62.94,6.04 70.76,13.87 100.1,13.87 102.41,16.18 | 101.17,17.42 v101.17,19.56 | 102.41,16.18 108.99,9.6 116.64,9.6 117.35,10.31 117.35,25.25 120.02,27.91 120.37,27.91 J11.2 | 102.41,16.18 101.17,17.42
BATGND
  Top 0.152: 94.41,41.07 94.41,36.8 IC3.6 | 94.41,41.07 93.7,41.78 92.99,41.78 91.92,40.72 91.92,40.54 90.86,39.47 90.5,39.47 90.32,39.29 90.32,35.38 90.68,35.03 C14.1 90.68,34.85 88.72,32.89 85.17,32.89 83.03,35.03 82.5,35.03 IC1.4 | 94.41,41.07 96.9,41.07 101.7,45.87 105.08,45.87 SW3.P$2
GND  (via drill 0.35)
  Top 0.152: v50.32,5.69 49.78,5.16 49.25,5.16 IC6.4 | C20.2 44.45,7.82 47.65,11.02 47.83,11.02 48.9,12.09 POT3.P$1 | v97.08,9.6 96.55,9.07 96.01,9.07 C17.2 | C28.2 99.57,18.49 99.57,17.6 101.17,16 101.17,14.4 98.86,12.09 97.08,12.09 POT6.P$1 | 67.21,8.89 67.21,9.96 65.08,12.09 POT4.P$1 | 67.21,8.89 67.21,8 R48.1 | 62.76,5.16 62.76,7.29 62.05,8 C23.2 | 62.76,5.16 62.76,3.73 62.59,3.56 61.16,3.56 60.27,4.45 R50.2 | C26.2 75.39,7.82 75.39,4.62 C25.2 | C18.2 91.21,5.16 91.21,7.29 90.32,8.18 90.32,9.6 90.14,9.78 82.5,9.78 81.08,8.36 81.08,4.09 80.9,3.91 76.1,3.91 75.56,4.45 C25.2 | 62.76,5.16 71.48,5.16 72.9,3.73 74.68,3.73 75.39,4.45 C25.2 | POT5.P$1 80.9,12.09 78.41,9.6 76.99,9.6 75.39,8 C26.2 | 67.21,8.89 74.32,8.89 75.21,8 C26.2 | IC4.11 110.06,35.74 110.06,36.27 112.37,38.58 112.37,42.32 R52.1 112.55,42.49 112.55,43.74 116.1,47.3 | R41.1 91.75,43.03 94.06,45.34 100.64,45.34 101.88,46.58 103.83,46.58 104.37,47.12 107.39,47.12 107.92,46.58 111.48,46.58 112.72,47.83 LED1.K 112.9,48.01 113.79,48.9 115.75,48.9 116.28,48.36 116.28,47.47 116.1,47.3 | 116.1,47.3 121.79,41.6 121.79,33.96 120.55,32.72 120.55,31.11 J11.1 | R8.1 19.74,45.34 20.62,46.23 22.4,46.23 26.14,42.49 26.85,42.49 R10.1 27.03,42.49 29.69,45.16 30.58,45.16 R12.1 30.76,45.34 30.76,45.87 31.47,46.58 | R24.1 63.48,45.16 62.94,45.16 60.27,42.49 59.92,42.49 R22.1 59.74,42.49 58.67,42.49 54.94,46.23 53.52,46.23 52.63,45.34 R20.1 52.45,45.16 51.92,45.16 49.25,42.49 48.9,42.49 R18.1 48.72,42.49 48.18,42.49 44.45,46.23 42.67,46.23 41.78,45.34 R16.1 41.6,45.16 40.89,45.16 38.23,42.49 37.87,42.49 R14.1 37.69,42.49 37.16,42.49 33.07,46.58 31.47,46.58
  Top 0.152: R54.1 94.94,31.11 95.48,31.65 95.48,34.14 IC3.2 95.66,34.31 94.94,35.03 94.59,35.03 91.21,38.41 R53.1 91.21,38.58 91.21,38.94 v93.34,41.07 | v70.94,44.45 70.94,42.49 R26.1 | v16,44.27 16,42.49 R6.1 | v9.6,44.09 9.6,44.27 8.71,45.16 R4.1 | v31.47,48.72 31.47,46.58
  Bottom 0.152: POT1.P$1 17.07,12.09 20.09,12.09 21.16,11.02 31.83,11.02 32.89,12.09 POT2.P$1 33.07,12.09 39.12,12.09 40.18,11.02 47.83,11.02 48.9,12.09 POT3.P$1 49.07,12.09 50.32,10.85 | 50.32,10.85 v50.32,5.69 | 97.08,11.02 97.08,12.09 POT6.P$1 | 97.08,11.02 v97.08,9.6 107.92,9.6 109.35,8.18 115.75,8.18 120.55,12.98 120.55,16 J10.1 120.73,16.18 120.73,18.31 121.79,19.38 121.79,29.69 120.55,30.94 J11.1 | 97.08,11.02 82.14,11.02 81.08,12.09 POT5.P$1 | 50.32,10.85 63.65,10.85 64.9,12.09 POT4.P$1 | 70.94,47.65 v70.94,44.45 | 70.94,47.65 71.83,48.54 J6.1 | J6.1 72.01,48.72 72.72,49.43 80.54,49.43 81.25,48.72 83.57,48.72 J9.1 83.74,48.54 86.77,45.52 88.37,45.52 89.79,44.09 | v93.34,41.07 92.81,41.07 89.79,44.09 | v9.6,44.09 15.82,44.09 v16,44.27 16,47.83 16.71,48.54 J1.1 16.89,48.72 22.4,48.72 23.29,49.61 26.85,49.61 27.74,48.72 J2.1 27.91,48.72 v31.47,48.72 33.43,48.72 34.31,49.61 37.87,49.61 38.76,48.72 J3.1 38.94,48.72 44.27,48.72 45.16,49.61 48.9,49.61 49.78,48.72 J4.1 49.96,48.72 55.3,48.72 56.19,49.61 59.92,49.61 60.81,48.72 J5.1 60.98,48.72 61.87,49.61 68.99,49.61 70.94,47.65 | 70.94,47.65 J6.1 | 89.79,44.09 90.5,44.81 107.39,44.81 110.41,47.83 112.72,47.83 LED1.K
N$1  (via drill 0.35)
  Top 0.152: v13.34,33.25 14.94,31.65 C8.+
  Bottom 0.152: v13.34,33.25 13.34,33.96 12.27,35.03 J1.4 12.27,35.2 16.36,39.29 16.71,39.29 J1.2
N$2
  Top 0.152: R2.1 77.52,37.52 83.74,37.52 88.01,41.78 88.01,46.05 87.66,46.41 LED2.K
N$3
  Top 0.152: R6.2 17.42,42.32 16,40.89 16,39.83 R5.1 15.82,39.65 11.91,35.74 11.91,31.65 C8.- 11.73,31.47 11.73,30.94 3.56,22.76 3.56,6.76 4.27,6.04 6.22,6.04 9.42,2.85 12.27,2.85 12.62,3.2 12.62,4.62 11.02,6.22 11.02,12.09 POT1.P$4
N$4  (via drill 0.35)
  Top 0.152: v86.41,36.09 82.32,36.09 81.97,35.74 81.97,35.2 IC1.5 | v87.66,34.85 89.08,34.85 C14.2 | v85.52,31.83 85.52,30.58 R40.2
  Bottom 0.152: v87.66,34.85 86.94,35.56 | 86.94,35.56 v86.41,36.09 | v85.52,31.83 85.52,33.07 85.34,33.25 85.34,33.96 86.94,35.56
N$5
  Top 0.152: C29.+ 8.53,7.82 8.53,10.67 7.82,11.38 7.82,12.98 8,13.16 14.05,13.16 14.94,12.27 POT1.P$2
N$6
  Top 0.152: R39.2 87.12,42.49 83.92,42.49 83.03,41.6 81.43,41.6 79.65,43.38 76.45,43.38 75.56,44.27 IC2.5
N$7  (via drill 0.35)
  Top 0.152: R42.2 114.68,9.07 114.68,7.11 114.15,6.58 114.15,5.33 113.97,5.16 112.55,5.16 112.37,5.33 112.37,5.87 108.81,9.42 C15.+ 108.64,9.6 v108.64,11.02 | v105.08,29.34 105.26,29.34 106.15,30.23 IC4.1
  Bottom 0.152: v105.08,29.34 105.08,28.8 103.83,27.56 103.83,15.82 v108.64,11.02
N$8  (via drill 0.35)
  Top 0.152: v9.25,40.01 9.25,35.03 C2.+
  Bottom 0.152: v9.25,40.01 9.25,43.38 8.89,43.74 8.89,46.41 9.07,46.58 J1.3
N$9
  Top 0.152: C30.+ 14.22,3.91 14.22,10.85 12.98,12.09 POT1.P$3
N$10
  Top 0.152: R2.2 75.56,37.52 75.56,41.6 IC2.1
N$11
  Top 0.152: IC3.5 95.66,36.63 96.37,36.63 IC3.4
N$12
  Top 0.152: IC3.1 94.41,34.14 94.41,32.36 93.17,31.11 R54.2 92.99,31.11 91.57,32.54 84.99,32.54 83.74,33.78 82.5,33.78 IC1.3
N$13  (via drill 0.35)
  Top 0.152: R4.2 10.31,45.16 10.31,42.85 R3.1 10.13,42.67 10.13,41.96 6.22,38.05 6.22,35.03 C2.- 6.04,34.85 5.51,34.31 v5.51,33.6
  Bottom 0.152: v5.51,33.6 5.51,24.71 4.27,23.47 4.27,15.11 7.11,12.27 8.89,12.27 POT1.P$5
N$14
  Top 0.152: R53.2 92.99,38.41 92.99,37.16 94.23,35.92 95.12,35.92 96.37,34.67 96.37,34.31 IC3.3 96.37,34.14 96.37,30.94 94.94,29.52 85.17,29.52 81.97,32.72 81.97,33.78 IC1.2
N$15
  Top 0.152: 108.46,33.43 116.46,33.43 R46.1 | 108.46,33.43 107.57,34.31 107.57,35.56 IC4.13 | 108.46,33.43 108.1,33.07 108.1,29.16 108.99,28.27 108.99,27.03 POT14.2.1
N$17  (via drill 0.35)
  Top 0.152: C16.+ 110.95,4.98 111.12,4.8 114.15,4.8 114.86,5.51 114.86,5.87 R43.2 115.04,6.04 116.28,7.29 v116.28,10.31 | v114.86,29.34 113.97,30.23 IC4.7
  Bottom 0.152: v114.86,29.34 114.86,28.8 116.28,27.38 v116.28,10.31
N$19
  Top 0.152: R28.2 15.29,20.27 15.29,19.38 11.56,15.65 POT7.2.2
N$20
  Top 0.152: R28.1 13.69,20.45 10.85,20.45 10.13,21.16 6.93,21.16 3.91,18.14 3.91,6.93 4.45,6.4 8.53,6.4 11.02,3.91 C30.-
N$21  (via drill 0.35)
  Top 0.152: v119.13,25.6 119.13,39.83 118.59,40.36 118.59,42.49 C22.-
  Bottom 0.152: v119.13,25.6 119.13,24.18 118.77,23.82 J10.3
N$22  (via drill 0.35)
  Top 0.152: 28.27,42.14 28.45,42.32 R10.2 28.27,42.14 | 28.27,42.14 27.03,40.89 27.03,39.83 R9.1 | POT2.P$4 27.03,12.09 22.05,7.11 19.02,7.11 18.67,7.47 18.67,8.89 23.29,13.51 32,13.51 33.6,15.11 33.6,19.74 32,21.34 30.94,21.34 30.58,20.98 30.58,19.74 30.4,19.56 28.98,19.56 28.09,20.45 28.09,24.54 24,28.63 24,31.11 C9.- 24,31.29 v25.25,32.54 | v29.69,40.72 28.27,42.14
  Bottom 0.152: v29.69,40.72 29.69,36.98 v25.25,32.54
N$23  (via drill 0.35)
  Top 0.152: v106.5,22.76 103.83,25.43 103.83,28.63 97.43,35.03 97.43,40.18 99.92,42.67 100.64,42.67 C21.-
  Bottom 0.152: v106.5,22.76 106.5,21.34 107.04,20.8 J10.4 107.21,20.62 111.3,16.54 111.3,16.18 J10.2
N$24  (via drill 0.35)
  Top 0.152: R45.2 101.88,33.78 101.88,34.49 97.79,38.58 97.79,40.01 99.39,41.6 v102.41,41.6 102.77,41.6 103.83,42.67 C21.+ | v112.72,37.34 113.79,36.27 113.79,35.74 IC4.8
  Bottom 0.152: v112.72,37.34 107.39,37.34 103.12,41.6 v102.41,41.6
N$25  (via drill 0.35)
  Top 0.152: R46.2 118.24,33.6 118.24,35.92 118.77,36.45 118.77,39.65 115.93,42.49 115.39,42.49 C22.+ 115.21,42.49 v113.26,40.54 | v109.88,40.54 106.32,36.98 106.32,35.74 IC4.14
  Bottom 0.152: v113.26,40.54 v109.88,40.54
N$26
  Top 0.152: C31.+ 20.27,8.36 20.27,9.42 24,13.16 30.05,13.16 30.94,12.27 POT2.P$2
N$27
  Top 0.152: R29.2 25.25,20.27 25.25,18.49 22.4,15.65 POT8.1.2
N$28  (via drill 0.35)
  Top 0.152: v25.25,33.6 27.03,31.83 27.03,31.29 C9.+
  Bottom 0.152: v25.25,33.6 24.71,33.6 23.29,35.03 J2.4 23.29,35.2 27.38,39.29 27.74,39.29 J2.2
N$29  (via drill 0.35)
  Top 0.152: v19.38,38.76 20.45,37.69 20.45,35.03 C3.+
  Bottom 0.152: v19.38,38.76 19.38,45.87 20.09,46.58 J2.3
N$30
  Top 0.152: R29.1 23.65,20.27 23.65,18.49 20.8,15.65 20.8,12.09 17.07,8.36 C31.-
N$31  (via drill 0.35)
  Top 0.152: R8.2 21.34,45.16 21.34,42.85 R7.1 21.16,42.67 v21.16,39.29 | v18.14,36.27 18.14,35.74 17.42,35.03 C3.- 17.25,34.85 17.25,31.47 15.47,29.69 15.47,24.89 19.74,20.62 v19.74,12.98
  Bottom 0.152: v18.14,36.27 v21.16,39.29 | v19.74,12.98 20.45,12.27 24.89,12.27 POT2.P$5
N$32
  Top 0.152: R30.2 31.29,20.27 31.29,18.49 28.45,15.65 POT8.2.2
N$33  (via drill 0.35)
  Top 0.152: v105.97,37.69 106.32,37.69 108.46,39.83 108.46,42.32 R51.2 | 110.41,32.18 110.41,30.76 110.06,30.4 IC4.4 | 110.41,32.18 v110.41,32.72 | C28.1 97.43,18.67 97.43,20.62 93.7,24.36 93.7,26.14 93.88,26.31 v96.72,26.31 97.26,26.31 99.57,24 102.41,24 103.83,22.58 L2.2 | v108.81,32.18 110.41,32.18
  Bottom 0.152: v105.97,37.69 105.97,37.16 v110.41,32.72 | v108.81,32.18 103.12,32.18 97.26,26.31 v96.72,26.31
N$34  (via drill 0.35)
  Top 0.152: v87.48,37.16 82.86,37.16 81.43,35.74 81.43,35.2 IC1.6 | v91.21,40.89 93.34,43.03 R41.2
  Bottom 0.152: v91.21,40.89 v87.48,37.16
N$35
  Top 0.152: R27.1 7.64,20.27 7.64,19.38 4.27,16 4.27,8.89 5.33,7.82 C29.-
N$36
  Top 0.152: R30.1 29.87,20.45 29.87,20.8 30.76,21.69 32.18,21.69 34.14,19.74 34.14,11.2 31.47,8.53 29.69,8.53 27.38,6.22 27.38,5.16 27.03,4.8 23.82,4.8 22.76,5.87 C32.-
N$37
  Top 0.152: C32.+ 25.96,6.04 25.96,9.07 28.98,12.09 POT2.P$3
N$38
  Top 0.152: C33.+ 34.14,7.47 39.83,13.16 46.05,13.16 46.94,12.27 POT3.P$2
N$39
  Top 0.152: R31.1 39.65,20.27 39.65,17.6 34.49,12.45 34.49,11.02 30.94,7.47 C33.-
N$40
  Top 0.152: R32.1 45.87,20.45 45.87,20.8 46.76,21.69 48.18,21.69 50.85,19.02 50.85,11.91 44.98,6.04 42.85,6.04 40.36,3.56 36.8,3.56 35.92,4.45 C34.-
N$41  (via drill 0.35)
  Top 0.152: R13.1 37.87,39.83 37.87,40.72 39.47,42.32 R14.2 39.65,42.32 v40.72,41.25 | v40.72,39.12 34.31,32.72 34.31,31.47 C10.- 34.31,31.29 35.38,30.23 37.34,30.23 39.47,28.09 39.47,24.36 44.27,19.56 46.41,19.56 46.58,19.74 46.58,20.98 46.94,21.34 48.01,21.34 50.49,18.85 50.49,15.11 50.14,14.76 v50.14,13.34
  Bottom 0.152: v40.72,41.25 v40.72,39.12 | v50.14,13.34 44.09,13.34 43.03,12.27 POT3.P$4
N$42
  Top 0.152: C34.+ 39.12,4.62 39.12,6.22 44.98,12.09 POT3.P$3
N$43
  Top 0.152: R31.2 41.25,20.27 41.25,17.42 39.47,15.65 POT9.1.2
N$44  (via drill 0.35)
  Top 0.152: v35.74,33.07 37.34,31.47 C10.+
  Bottom 0.152: v35.74,33.07 35.74,33.6 34.31,35.03 J3.4 34.31,35.2 38.41,39.29 38.76,39.29 J3.2
N$45  (via drill 0.35)
  Top 0.152: v31.29,37.16 31.29,35.2 C4.+
  Bottom 0.152: v31.29,37.16 31.29,46.58 J3.3
N$46  (via drill 0.35)
  Top 0.152: v19.02,13.69 19.02,18.31 16,21.34 15.82,21.34 12.98,24.18 C35.+
  Bottom 0.152: v19.02,13.69 49.43,13.69 49.78,14.05 61.16,14.05 62.94,12.27 POT4.P$2
N$47
  Top 0.152: R12.2 32.36,45.16 32.36,42.85 R11.1 32.18,42.67 32.18,39.12 28.27,35.2 C4.- 28.09,35.03 25.6,35.03 22.4,31.83 22.4,30.4 22.58,30.23 22.58,24.89 20.45,22.76 20.45,12.62 18.85,11.02 17.6,11.02 15.47,8.89 15.47,7.47 18.49,4.45 33.25,4.45 40.89,12.09 POT3.P$5
N$48
  Top 0.152: R32.2 47.3,20.27 47.3,17.6 45.34,15.65 POT9.2.2
N$49  (via drill 0.35)
  Top 0.152: v31.11,22.4 29.52,24 C36.+ | v53.16,17.42 53.16,16.89 55.83,14.22 59.03,14.22 60.98,12.27 POT4.P$3
  Bottom 0.152: v31.11,22.4 48.18,22.4 v53.16,17.42
N$50  (via drill 0.35)
  Top 0.152: v51.56,20.45 55.65,20.45 R33.1 | v11.2,23.11 10.85,23.11 9.78,24.18 C35.-
  Bottom 0.152: v51.56,20.45 50.67,20.45 48.01,23.11 v11.2,23.11
N$51  (via drill 0.35)
  Top 0.152: v58.67,20.45 61.7,20.45 R34.1 | v26.14,25.43 26.14,24.18 C36.-
  Bottom 0.152: v58.67,20.45 52.63,20.45 48.36,24.71 26.85,24.71 v26.14,25.43
N$52
  Top 0.152: C37.+ 45.7,24.71 56.19,24.71 58.85,22.05 71.48,22.05 72.54,20.98 72.54,16.71 71.48,15.65 71.48,11.2 72.01,10.67 77.52,10.67 78.94,12.09 POT5.P$2
N$53
  Top 0.152: R35.1 71.65,20.45 64.9,20.45 63.65,21.69 49.78,21.69 47.83,23.65 43.56,23.65 42.49,24.71 C37.-
N$54  (via drill 0.35)
  Top 0.152: v73.25,24.54 62.41,24.54 C38.+ | v82.14,18.14 84.28,16 84.28,15.11 83.57,14.4 73.25,14.4 71.83,12.98 71.83,11.38 72.19,11.02 75.92,11.02 76.99,12.09 POT5.P$3
  Bottom 0.152: v73.25,24.54 75.74,24.54 v82.14,18.14
N$55
  Top 0.152: R27.2 9.25,20.27 9.25,19.38 5.51,15.65 POT7.1.2
N$56  (via drill 0.35)
  Top 0.152: v74.68,20.45 77.7,20.45 R36.1 | v71.48,23.65 60.1,23.65 59.21,24.54 C38.-
  Bottom 0.152: v71.48,23.65 v74.68,20.45
N$57
  Top 0.152: C39.+ 78.41,24.71 84.81,24.71 88.54,20.98 88.54,15.29 90.68,13.16 94.06,13.16 94.94,12.27 POT6.P$2
N$58
  Top 0.152: R18.2 50.49,42.32 48.9,40.72 48.9,39.83 R17.1 48.72,39.65 45.87,36.8 45.87,31.65 C11.- 45.7,31.47 40.89,26.67 40.89,24 41.6,23.29 47.65,23.29 51.56,19.38 51.56,17.96 55.65,13.87 57.25,13.87 POT4.P$4
N$59
  Top 0.152: R37.1 87.66,20.45 83.92,20.45 80.72,23.65 76.28,23.65 75.21,24.71 C39.-
N$60
  Top 0.152: R33.2 57.25,20.27 57.25,16.54 56.36,15.65 POT10.1.2
N$61  (via drill 0.35)
  Top 0.152: v105.44,18.85 105.44,9.6 C15.- | v102.23,29.16 v98.32,33.07
  Bottom 0.152: J9.4 79.12,35.2 79.65,35.2 83.57,39.12 J9.2 83.74,39.12 84.45,39.12 90.5,33.07 v98.32,33.07 | v105.44,18.85 105.44,26.49 105.08,26.85 POT14.1.2 105.08,27.03 105.79,27.74 105.79,29.69 105.44,30.05 104.72,30.05 103.83,29.16 v102.23,29.16
N$62  (via drill 0.35)
  Top 0.152: v47.12,33.43 48.9,31.65 C11.+
  Bottom 0.152: 45.52,35.03 45.34,35.2 J4.4 45.52,35.03 | 45.52,35.03 v47.12,33.43 | 45.52,35.03 49.78,39.29 J4.2
N$63  (via drill 0.35)
  Top 0.152: v42.49,38.58 42.49,35.03 C5.+
  Bottom 0.152: v42.49,38.58 42.49,46.41 42.32,46.58 J4.3
N$64
  Top 0.152: R38.1 93.7,20.45 93.7,23.47 91.92,25.25 C40.-
N$65
  Top 0.152: R16.2 43.38,45.16 43.38,42.85 R15.1 43.2,42.67 43.2,40.36 39.47,36.63 39.47,35.03 C5.- 39.47,34.85 39.83,34.49 39.83,24.54 41.43,22.94 47.47,22.94 51.21,19.2 51.21,17.78 55.47,13.51 55.65,13.51 56.9,12.27 POT4.P$5
N$66
  Top 0.152: R34.2 63.3,20.27 63.3,16.71 62.23,15.65 POT10.2.2
N$67
  Top 0.152: C40.+ 95.12,25.25 95.12,24.54 101.52,18.14 101.52,14.22 98.32,11.02 94.06,11.02 92.99,12.09 POT6.P$3
N$75
  Top 0.152: R22.2 61.52,42.32 59.92,40.72 59.92,39.83 R21.1 59.74,39.65 56.01,35.92 56.01,31.47 C12.- 56.01,31.29 56.36,30.94 56.36,25.07 58.5,22.94 78.41,22.94 84.63,16.71 84.63,14.94 83.74,14.05 76.81,14.05 75.03,12.27 POT5.P$4
N$77
  Top 0.152: R35.2 73.25,20.27 73.25,15.65 POT11.1.2
N$78  (via drill 0.35)
  Top 0.152: v58.32,33.78 58.32,32.72 59.03,32 59.03,31.47 C12.+
  Bottom 0.152: v58.32,33.78 57.61,33.78 56.36,35.03 J5.4 56.36,35.2 60.45,39.29 60.81,39.29 J5.2
N$79  (via drill 0.35)
  Top 0.152: v53.52,37.16 C6.+
  Bottom 0.152: v53.52,37.16 53.52,46.23 53.16,46.58 J5.3
N$81  (via drill 0.35)
  Top 0.152: R20.2 54.41,45.16 54.41,42.85 R19.1 54.23,42.67 54.23,38.94 50.49,35.2 C6.- 50.49,35.03 v51.74,33.78 | v64.36,19.2 v70.76,12.8
  Bottom 0.152: v70.76,12.8 71.3,12.27 72.9,12.27 POT5.P$5 | v64.36,19.2 64.36,21.16 v51.74,33.78
N$82
  Top 0.152: R36.2 79.3,20.27 79.3,15.82 79.12,15.65 POT11.2.2
N$91
  Top 0.152: R26.2 72.54,42.32 70.94,40.72 70.94,39.83 R25.1 70.76,39.65 67.92,36.8 67.92,31.47 C13.- 67.92,31.29 70.05,29.16 94.94,29.16 99.39,24.71 104.01,24.71 105.08,23.65 105.08,21.34 104.72,20.98 104.72,16.89 98.5,10.67 92.46,10.67 91.03,12.09 POT6.P$4
N$93
  Top 0.152: R37.2 89.43,20.27 89.43,16.18 89.97,15.65 POT12.1.2
N$94  (via drill 0.35)
  Top 0.152: v68.99,33.43 70.94,31.47 C13.+
  Bottom 0.152: v68.99,33.43 67.39,35.03 J6.4 67.39,35.2 71.48,39.29 71.83,39.29 J6.2
N$95  (via drill 0.35)
  Top 0.152: v64.36,40.18 64.36,35.03 C7.+
  Bottom 0.152: v64.36,40.18 64.36,46.41 64.19,46.58 J6.3
N$97  (via drill 0.35)
  Top 0.152: R24.2 65.43,45.16 65.43,42.85 R23.1 65.25,42.67 65.25,42.14 62.41,39.29 62.41,36.09 | 62.41,36.09 61.34,35.03 C7.- | v83.74,19.56 88.9,14.4 88.9,12.27 POT6.P$5 | 62.41,36.09 v62.76,36.09
  Bottom 0.152: v83.74,19.56 81.79,19.56 67.74,33.6 65.25,33.6 v62.76,36.09
N$98
  Top 0.152: R38.2 95.48,20.27 95.48,16 95.83,15.65 POT12.2.2
N$114
  Top 0.152: R1.1 98.68,39.47 100.1,40.89 104.37,40.89 105.79,42.32 105.79,43.03 108.99,46.23 113.61,46.23 115.21,47.83 LED1.A
N$115
  Top 0.152: D1.A 100.46,4.45 98.15,4.45 96.55,2.85 96.01,2.85 IC5.1 95.83,2.67 94.59,2.67 94.06,2.13 90.14,2.13 85.52,6.76 83.92,6.76 L1.P$2
N$116
  Top 0.152: R44.1 89.61,8.71 89.61,5.16 C18.1 89.61,4.98 90.32,4.27 91.92,4.27 92.28,4.62 93.17,4.62 IC5.4
N$117  (via drill 0.35)
  Top 0.152: v44.81,3.38 44.45,3.02 44.45,2.13 R47.1 | v64.72,3.38 68.1,3.38 68.99,4.27 C19.2 | v68.99,6.22 68.99,7.82 R48.2 | v94.94,5.69 95.83,4.8 IC5.3
  Bottom 0.152: v44.81,3.38 v64.72,3.38 66.14,3.38 v68.99,6.22 69.52,5.69 v94.94,5.69
N$118
  Top 0.152: IC6.2 49.25,6.4 51.03,6.4 52.98,4.45 56.01,4.45 C24.2 56.19,4.62 56.19,5.33 | 56.19,5.33 56.19,8.18 R49.2 | 56.19,5.33 61.16,5.33 61.87,4.62 R50.1
N$119
  Top 0.152: IC6.6 53.7,5.87 54.23,5.87 55.12,6.76 55.12,8.71 55.47,9.07 64.72,9.07 68.28,5.51 72.72,5.51 73.61,4.62 C25.1
OUT-L  (via drill 0.35)
  Top 0.152: v87.66,14.58 87.66,11.56 88.19,11.02 89.97,11.02 90.68,10.31 100.81,10.31 101.7,9.42 101.7,8.71 106.5,3.91 114.5,3.91 116.99,6.4 116.99,10.67 116.64,11.02 115.04,11.02 113.26,9.25 R42.1 | v104.01,30.4 105.44,31.83 106.68,31.83 107.39,31.11 107.39,30.4 IC4.2 | v92.1,20.27 92.1,15.65 POT12.1.1
  Bottom 0.152: POT7.1.1 7.64,15.47 8.71,14.4 23.29,14.4 24.36,15.47 POT8.1.1 24.54,15.47 25.6,14.4 40.18,14.4 41.25,15.47 POT9.1.1 41.43,15.47 42.49,14.4 57.07,14.4 58.14,15.47 POT10.1.1 58.32,15.47 59.38,14.4 73.97,14.4 75.03,15.47 POT11.1.1 75.21,15.47 75.56,15.47 76.63,14.4 87.48,14.4 v87.66,14.58 89.26,14.58 89.43,14.4 90.86,14.4 91.92,15.47 POT12.1.1 | v104.01,30.4 102.23,30.4 v92.1,20.27
OUT-L1
  Top 0.152: 102.95,30.4 105.08,28.27 105.61,28.27 106.86,27.03 POT14.1.1 | 102.95,30.4 100.46,32.89 100.46,33.6 R45.1 | 102.95,30.4 106.86,34.31 106.86,36.8 107.04,36.98 107.92,36.98 108.1,36.8 108.1,34.31 108.64,33.78 111.3,33.78 112.37,34.85 112.37,35.56 IC4.9
OUT-R  (via drill 0.35)
  Top 0.152: 112.19,8.89 112.19,16.71 116.28,20.8 116.28,27.38 115.04,28.63 113.61,28.63 112.55,29.69 112.55,30.23 IC4.6 | 112.19,8.89 112.19,8.71 113.26,7.64 113.26,6.04 R43.1 | v110.41,8.89 112.19,8.89 | v98.5,12.8 96.9,14.4 95.12,14.4 94.06,15.47 POT12.2.1
  Bottom 0.152: POT12.2.1 93.88,15.65 92.81,16.71 78.59,16.71 77.52,15.65 77.17,15.65 POT11.2.1 76.99,15.65 76.63,15.65 75.56,16.71 61.34,16.71 60.27,15.65 POT10.2.1 60.1,15.65 59.03,16.71 44.81,16.71 43.74,15.65 43.38,15.65 POT9.2.1 43.2,15.65 42.14,16.71 27.91,16.71 26.85,15.65 26.49,15.65 POT8.2.1 26.31,15.65 25.25,16.71 11.02,16.71 9.96,15.65 9.6,15.65 POT7.2.1 | v110.41,8.89 109.17,8.89 105.26,12.8 v98.5,12.8
OUT-R1
  Top 0.152: C16.- 107.57,5.16 107.57,8.36 107.21,8.71 107.21,23.11 110.95,26.85 POT14.2.2
  Bottom 0.152: J9.3 75.92,46.58 77.7,46.58 81.25,43.03 90.32,43.03 100.28,33.07 108.99,33.07 110.95,31.11 110.95,27.03 POT14.2.2
USBGND  (via drill 0.35)
  Top 0.152: C27.2 86.41,35.03 88.72,37.34 88.72,42.49 R39.1 88.72,42.67 88.72,44.09 | 88.72,44.09 88.72,46.7 | 88.72,46.7 88.72,46.76 87.83,47.65 87.12,47.65 83.92,44.45 83.92,43.56 C1.2 83.74,43.38 v82.68,42.32 | v76.63,40.36 76.63,41.6 IC2.2 | 88.72,44.09 v90.86,44.09 | J8.GND 89.06,46.36 88.72,46.7 | v111.1,49.3 109.58,49.3 109.05,49.83 108.5,49.83 108.17,49.83 | 108.17,49.83 107.59,49.83 | SW3.P$1 108.17,49.83
  Bottom 0.152: v76.63,40.36 78.77,42.49 82.5,42.49 v82.68,42.32 | 114.33,44.09 120.37,38.05 120.37,37.52 J7.2 | v90.86,44.09 114.33,44.09 | 114.33,44.09 114,44.42 114,49 113.7,49.3 v111.1,49.3
V+  (via drill 0.35)
  Top 0.152: 52.81,6.76 52.81,5.33 52.98,5.16 53.52,5.16 IC6.5 | 52.81,6.76 52.98,6.93 53.52,6.93 IC6.8 | 45.87,3.38 45.87,2.13 R47.2 | 45.87,3.38 44.45,4.8 C20.1 | 66.14,4.27 63.83,4.27 62.76,3.2 57.07,3.2 56.9,3.38 48.01,3.38 | 66.14,4.27 67.21,4.27 C19.1 | 45.87,3.38 48.01,3.38 | v70.23,7.82 73.43,7.82 C26.1 | 66.14,4.27 v66.14,4.45 | v97.61,8.71 100.46,8.71 D1.C | 52.81,6.76 50.67,6.76 49.78,7.64 48.72,7.64 48.01,6.93 48.01,3.38
  Bottom 0.152: v66.14,4.45 69.52,7.82 v70.23,7.82 71.12,8.71 v97.61,8.71
VBAT  (via drill 0.35)
  Top 0.152: 101.17,39.47 100.46,39.47 R1.2 | 101.17,39.47 101.52,39.83 v107.39,39.83 | v87.3,31.83 87.3,30.58 R40.1 | v86.06,33.6 84.81,34.85 C27.1 | v82.14,31.11 76.45,36.8 76.45,38.05 77.34,38.94 77.34,41.6 IC2.3 | IC5.5 93.34,2.85 93.34,3.38 94.23,4.27 94.23,8.89 C17.1 94.06,8.89 91.39,8.89 R44.2 91.21,8.89 91.21,9.25 90.32,10.13 84.99,10.13 | 84.99,10.13 82.32,10.13 79.48,7.29 79.48,6.93 L1.P$1 | v83.03,20.27 83.03,18.85 84.99,16.89 84.99,10.13 | 101.17,39.47 101.17,36.09 102.95,34.31 102.95,33.07 v102.23,32.36
  Bottom 0.152: v107.39,39.83 111.48,39.83 116.64,34.67 120.37,34.67 J7.1 | 87.3,32.36 v87.3,31.83 86.59,31.11 83.03,31.11 | v86.06,33.6 87.3,32.36 | 83.03,31.11 v82.14,31.11 | v83.03,20.27 83.03,31.11 | 87.3,32.36 v102.23,32.36
VGND
  Top 0.152: IC4.3 108.81,30.23 108.81,29.69 109.53,28.98 110.41,28.98 111.12,29.69 111.12,30.23 IC4.5 111.3,30.4 111.3,31.11 112.9,32.72 117.17,32.72 117.35,32.89 117.35,34.31 115.57,36.09 115.21,36.09 113.26,38.05 112.37,38.05 111.3,36.98 111.3,35.74 IC4.10 111.12,35.56 111.12,34.85 110.41,34.14 109.53,34.14 108.81,34.85 108.81,35.56 IC4.12 108.81,35.74 108.81,36.27 110.59,38.05 110.59,42.32 R52.2 110.59,42.49 109.88,42.49 108.99,43.38 107.75,43.38 106.86,42.49 R51.1

### Text on the board
tNames: Analog-Mixer-OPA4134-K / 2018 Ali Momeni @ Pittsburgh